# EAGLE design ledstrip-control (EAGLE 7.4.0)
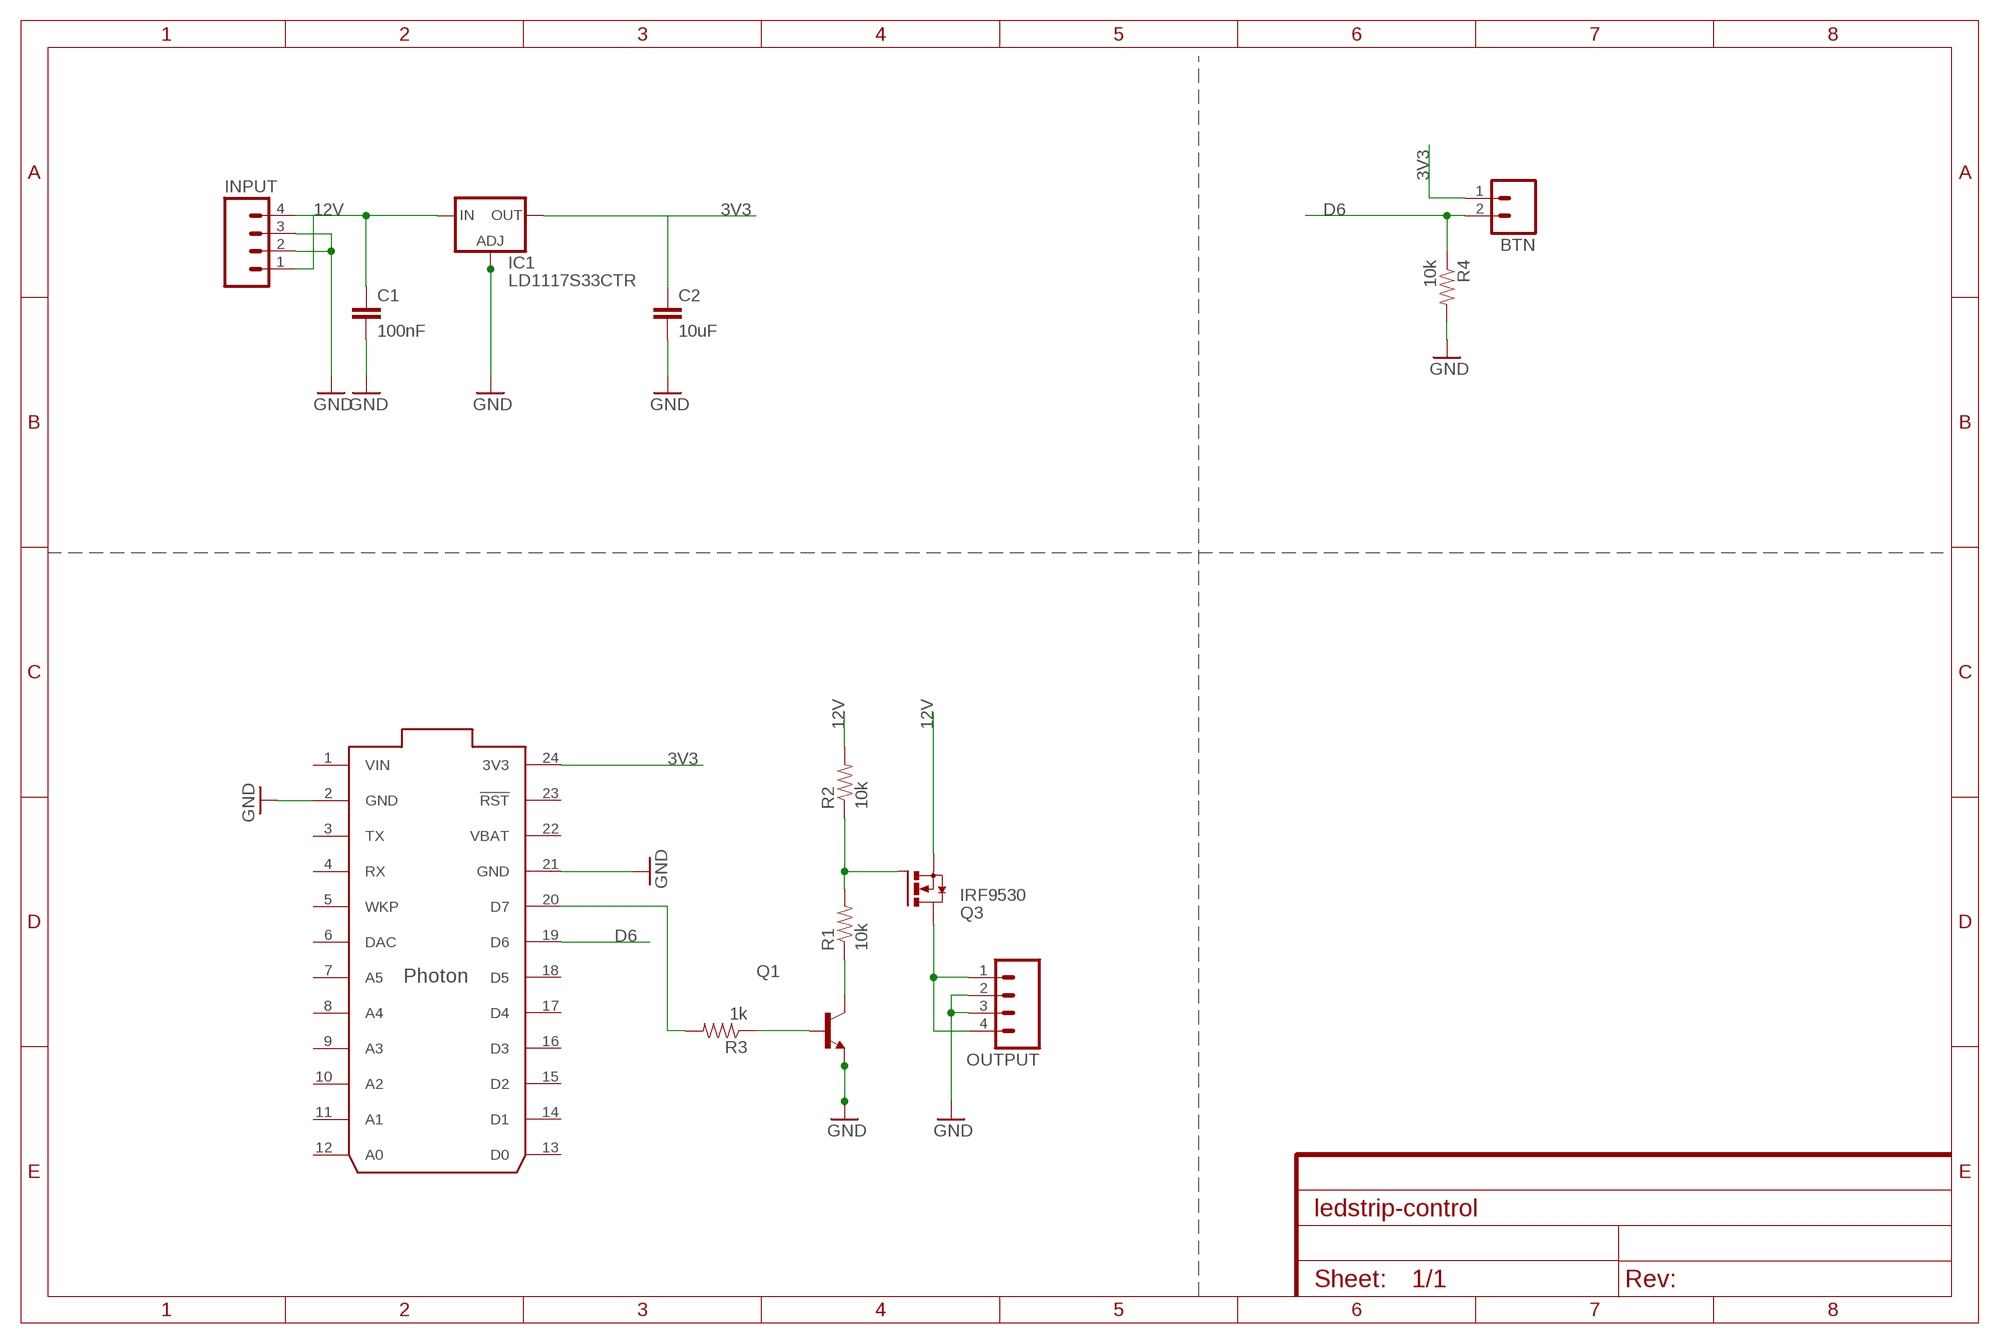
[diagram p0: schematic, sheet 1]
FRAME1 (FRAME-A4L): CNAME: Rians Home Automation - Led Strip Switch; CREVISION: 0.1; DESIGNER: Rian van Gijlswijk

## Parts
BTN  M02PTH  [1X02]
C1  100nF  CAPPTH  [CAP-PTH-SMALL]
C2  10uF  CAPPTH  [CAP-PTH-SMALL]
IC1  LD1117S33CTR  LD117AS33TR  [SOT223]
INPUT  M04PTH  [1X04]
OUTPUT  M04PTH  [1X04]
Q1  2N2222-NPN-TO18-EBC  [TO18]
Q3  IRF9530  IRF3704S  [D2PACK]
R1  10k  RESISTORAXIAL-0.3  [AXIAL-0.3]
R2  10k  RESISTORAXIAL-0.3  [AXIAL-0.3]
R3  1k  RESISTORAXIAL-0.3  [AXIAL-0.3]
R4  10k  RESISTORAXIAL-0.3  [AXIAL-0.3]
U1  PHOTON_WITH_HEADERS  [PHOTON]

## Nets
3V3: BTN.1 C2.1 IC1.4(OUT) U1.24(3V3)
12V: C1.1 IC1.3(IN) INPUT.1 INPUT.4 Q3.3(S) R2.P$2
D6: BTN.2 R4.P$1 U1.19(D6)
GND: C1.2 C2.2 IC1.1(ADJ) INPUT.2 INPUT.3 OUTPUT.2 OUTPUT.3 Q1.1(E) R4.P$2 U1.2(GND) U1.21(GND)
N$1: OUTPUT.1 OUTPUT.4 Q3.2(D)
N$2: Q3.1(G) R1.P$2 R2.P$1
N$3: Q1.3(C) R1.P$1
N$4: Q1.2(B) R3.P$1
N$5: R3.P$2 U1.20(D7)
Unconnected: U1.3(TX) U1.4(RX) U1.5(WKP) U1.6(DAC) U1.7(A5) U1.8(A4) U1.9(A3) U1.10(A2) U1.11(A1) U1.12(A0) U1.13(D0) U1.14(D1) U1.15(D2) U1.16(D3) U1.17(D4) U1.18(D5) U1.23(!RST)

## Power pins joined to a net without a drawn wire
VBAT: U1.22(VBAT)
VIN: U1.1(VIN)

## Library data of the parts
BTN = SparkFun-Connectors:M02: Standard 2-pin 0.1" header. Use with - straight break away headers ( PRT-00116) - right angle break away headers (PRT-00553) - swiss pins (PRT-00743) - machine pins (PRT-00117) - female headers (PRT-00115) Molex polarized connector foot print use with: PRT-08233 with associated crimp pins and housings. 2.54_SCREWTERM for use with PRT-10571. 3.5mm Screw Terminal footprints for PRT-08084 5mm Screw Terminal footprints for use with PRT-08432
C1 C2 = SparkFun-Passives:CAP: Capacitor Standard 0603 ceramic capacitor, and 0.1" leaded capacitor.
IC1 = v-reg:LD117A?*: Low drop fixed and adjustable positive voltage regulators 1 A Source: http://www.st.com/stonline/products/literature/ds/7194/ld1117axx.pdf; FARNELL: 1467779
INPUT OUTPUT = SparkFun-Connectors:M04: Header 4 Standard 4-pin 0.1" header. Use with straight break away headers (SKU : PRT-00116), right angle break away headers (PRT-00553), swiss pins (PRT-00743), machine pins (PRT-00117), and female headers (PRT-00115). Molex polarized connector foot print use with SKU : PRT-08231 with associated crimp pins and housings. 1MM SMD Version SKU: PRT-10208; PROD_ID: CONN-09696
Q1 = transistor:*-NPN-: NPN Transistror BF959 corrected 2008.03.06
Q3 = transistor-power:IRF3704: SMPS MOSFET HEXFET® Power MOSFET Source: http://www.irf.com/product-info/datasheets/data/irf3704.pdf; FARNELL: 9103155
R1-R4 = SparkFun-Passives:RESISTOR: Resistor Basic schematic elements and footprints for 0603, 1206, and PTH resistors.
U1 = Spark:PHOTON

## Board
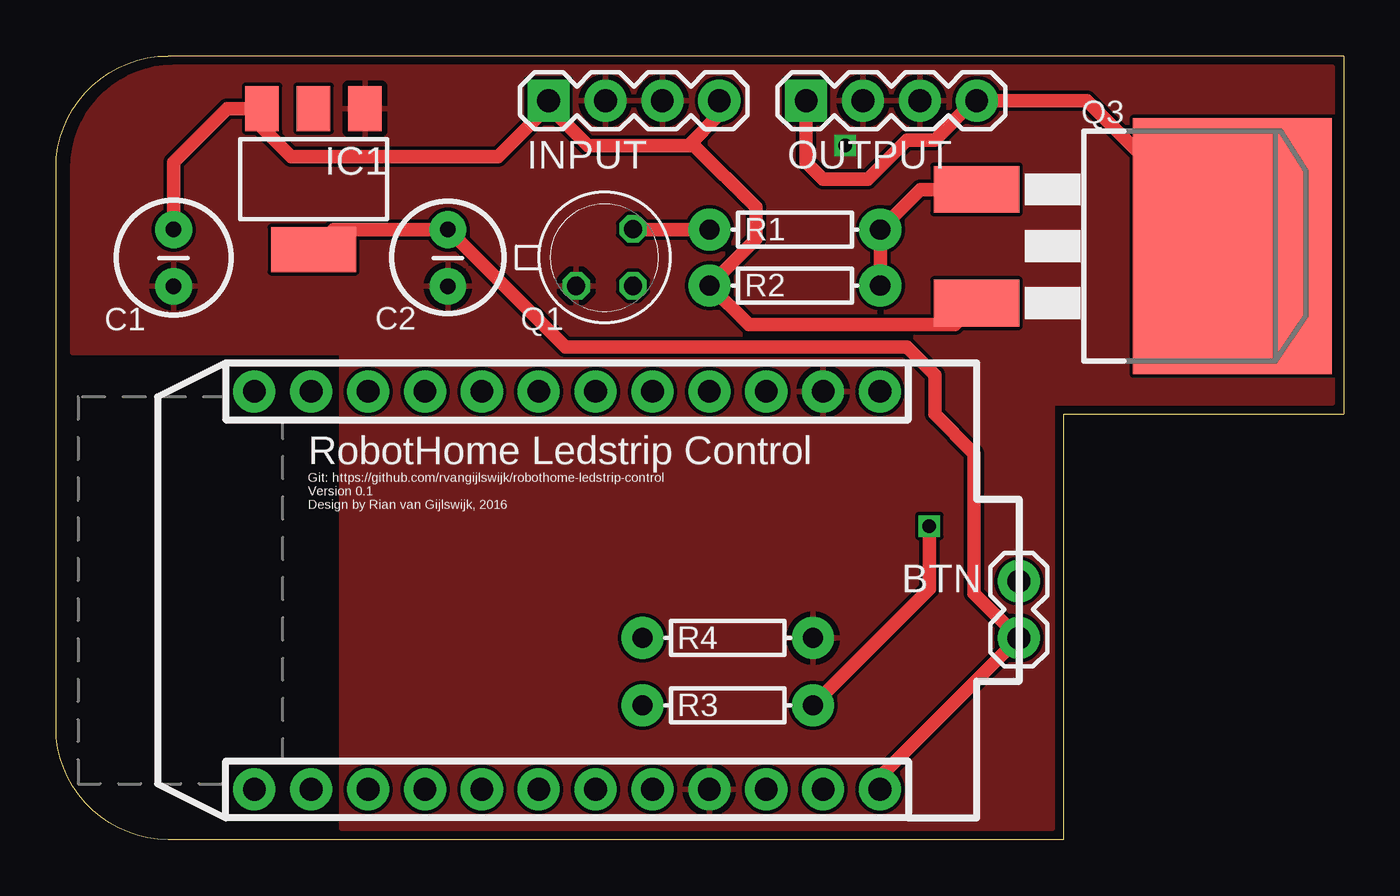
[diagram p1: board, top side]
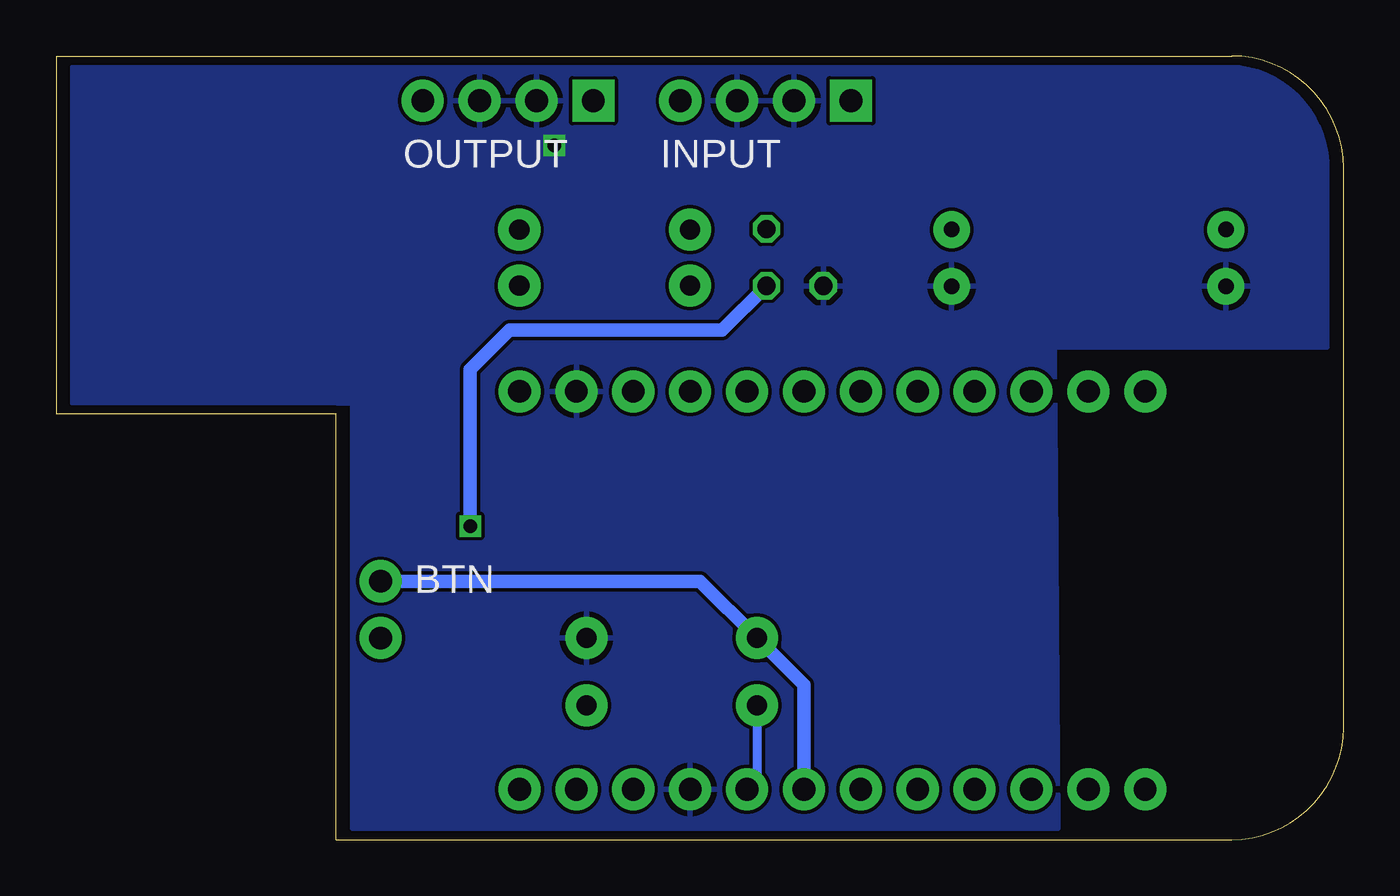
[diagram p2: board, bottom side, seen from below]

Size 57.5 x 35 mm. Coordinates in mm from the lower left corner, seen from the top.
Outline: 45,0 5,0 arc-90 0,5 0,30 arc-90 5,35 57.5,35 57.5,19 45,19 45,0
Copper layers (1*16): Top 0.0356mm / dielectric 1.5011mm / Bottom 0.0356mm
Design rules "LaenPCBOrder": minimum track width 6mil, minimum drill 13mil, track to track 6mil, track to pad 6mil, pad to pad 6mil, via to via 6mil, smd to smd 6mil, copper to edge 15mil, drill to drill 6mil, minimum pad ring 7mil, minimum via ring 7mil, stop-mask expansion 3mil, vias tented up to drill 0mil, thermal gap 10mil

### Footprints (pad centres in the part's own frame; a part is rotated, then mirrored left to right if it is on the bottom)
1X02 = drill 1.016 pad 1.88: 1 0,0; 2 2.54,0
CAP-PTH-SMALL = drill 0.7 pad 1.651: 1 0,0; 2 2.54,0
SOT223 = smd 1.5 x 2: 1 -2.3,-3.15; 2 0,-3.15; 3 2.3,-3.15 | smd 3.8 x 2: 4 0,3.15
1X04 = drill 1.016 pad 1.88 square: 1 0,0 | drill 1.016 pad 1.88: 2 2.54,0; 3 5.08,0; 4 7.62,0
TO18 = drill 0.813 octagon: 1 -1.27,-1.27; 2 1.27,-1.27; 3 1.27,1.27
D2PACK = smd 2.083 x 3.81: 1 -2.54,-8.89; 3 2.54,-8.89 | smd 11.43 x 8.89: 2 0,2.54
AXIAL-0.3 = drill 0.9 pad 1.88: P$1 -3.81,0; P$2 3.81,0
PHOTON = drill 1.016 pad 1.88: 1 1.27,32.258; 2 1.27,29.718; 3 1.27,27.178; 4 1.27,24.638; 5 1.27,22.098; 6 1.27,19.558; 7 1.27,17.018; 8 1.27,14.478; 9 1.27,11.938; 10 1.27,9.398; 11 1.27,6.858; 12 1.27,4.318; 13 19.05,4.318; 14 19.05,6.858; 15 19.05,9.398; 16 19.05,11.938; 17 19.05,14.478; 18 19.05,17.018; 19 19.05,19.558; 20 19.05,22.098; 21 19.05,24.638; 22 19.05,27.178; 23 19.05,29.718; 24 19.05,32.258

### Placement (x,y rotation side)
BTN  43,9 90 top
C1  5.25,27.25 270 top
C2  17.5,27.25 270 top
IC1  11.5,29.5 180 top
INPUT  22,33 0 top
OUTPUT  33.5,33 0 top
Q1  24.5,26 0 top
Q3  50,26.5 270 top
R1  33,27.25 0 top
R2  33,24.75 180 top
R3  30,6 180 top
R4  30,9 0 top
U1  4.54,21.29 270 top

### Tracks (layer width: path | path; a pad name or v marks a point on that pad's centre or on a via)
3V3
  Top 0.61: IC1.4 12.4,27.25 C2.1 22.75,22 38,22 39.25,20.75 39.25,19 41,17.25 41,11 BTN.1 36.8,2.8 U1.24
12V
  Top 0.61: C1.1 5.25,30.25 7.65,32.65 IC1.3 9.25,32.6 9.25,31.75 10.5,30.5 19.75,30.5 22,32.75 | INPUT.1 22,32.75 | 22,32.75 23.75,31 28.25,31 | 28.25,31 29.62,32.37 INPUT.4 | 28.25,31 28.5,31 31.25,28.25 31.25,26.81 R2.P$2 30.94,23 40.15,23 Q3.3
D6
  Bottom 0.61: BTN.2 28.73,11.54 R4.P$1 24.1,6.91 U1.19
GND  (via drill 0.6)
  other vias: 35.25,31
  pour Bottom: 12.75,0.5 13,34.5 56.75,34.5 56.75,19.5 44.25,19.5 44.25,0.5
  pour Top: 12.75,0.5 12.75,34.5 57,34.5 57,19.5 44.5,19.5 44.5,0.5
  pour Top: 12.75,34.5 5.25,34.5 arc90 0.75,30 0.75,21.75 12.75,21.75
  pour Bottom: 13,34.5 5.5,34.5 arc90 0.75,30.25 0.75,22 13,22
N$1
  Top 0.61: Q3.2 46.04,33 OUTPUT.4 41,33 39.25,31.25 38,31.25 36.25,29.5 34.25,29.5 33.5,30.25 OUTPUT.1
N$2
  Top 0.61: R2.P$1 R1.P$2 38.6,29.04 Q3.1
N$3
  Top 0.61: Q1.3 25.79,27.25 R1.P$1
N$4  (via drill 0.6)
  Top 0.61: v39,14 39,11.19 R3.P$1
  Bottom 0.61: Q1.2 27.75,22.75 37.25,22.75 39,21 v39,14
N$5
  Bottom 0.406: R3.P$2 26.19,2.69 U1.20

### Text on the board
tNames: RobotHome Ledstrip Control | Git: https://github.com/rvangijlswijk/robothome-ledstrip-control / Version 0.1 / Design by Rian van Gijlswijk, 2016
bNames: INPUT | OUTPUT | BTN